# EAGLE design XEPHITS (EAGLE 9.6.2)
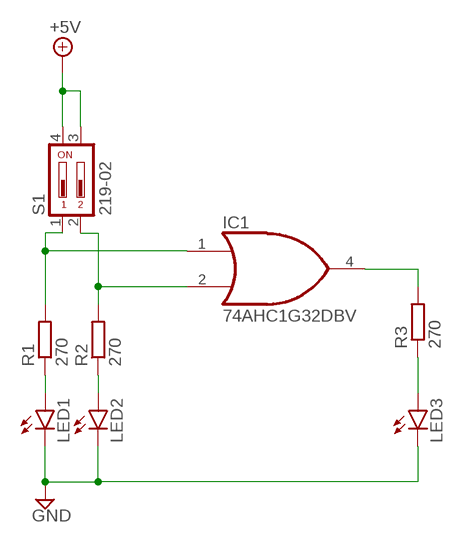
[diagram p0: schematic, sheet 1]

## Parts
IC1  74AHC1G32DBV  [SOT23-5]
LED1  LAP4-BOTTOM  [P47F-BOTTOM]
LED2  LAP4-BOTTOM  [P47F-BOTTOM]
LED3  LAP4-BOTTOM  [P47F-BOTTOM]
R1  270  R-EU_0207/2V  [0207/2V]
R2  270  R-EU_0207/2V  [0207/2V]
R3  270  R-EU_0207/2V  [0207/2V]
S1  219-02  [CTS-219-02]

## Nets
+5V: S1.3 S1.4
GND: LED1.C LED2.C LED3.C
N$1: IC1.2(I1) R2.2 S1.2
N$2: IC1.1(I0) R1.2 S1.1
N$3: LED1.A R1.1
N$4: LED2.A R2.1
N$5: IC1.4(O) R3.2
N$6: LED3.A R3.1

## Power pins joined to a net without a drawn wire
GND: IC1.3(GND)
VCC: IC1.5(VCC)

## Library data of the parts
IC1 = 74xx-little-us:74*1G32: 2-input OR gate
LED1-LED3 = led:*P4: PointLED® Enhanced Thinfilm LED TOP & BOTTOM mount LS P47F, LR P47F, LA P47F, LY P47F, LT P4SG, LB P4SG, LW P4SG Source: http://catalog.osram-os.com .. LA_LR_LS_LY_P47F_Pb_free.pdf
R1-R3 = rcl:R-EU_: RESISTOR, European symbol; SPICEPREFIX: R
S1 = switch-dil:219-02*: Surface Mount DIP Switch Series 219 SMT CTS Electronic Components Sourc: www.ctscorp.com; OC_FARNELL: unknown; OC_NEWARK: unknown

## Board
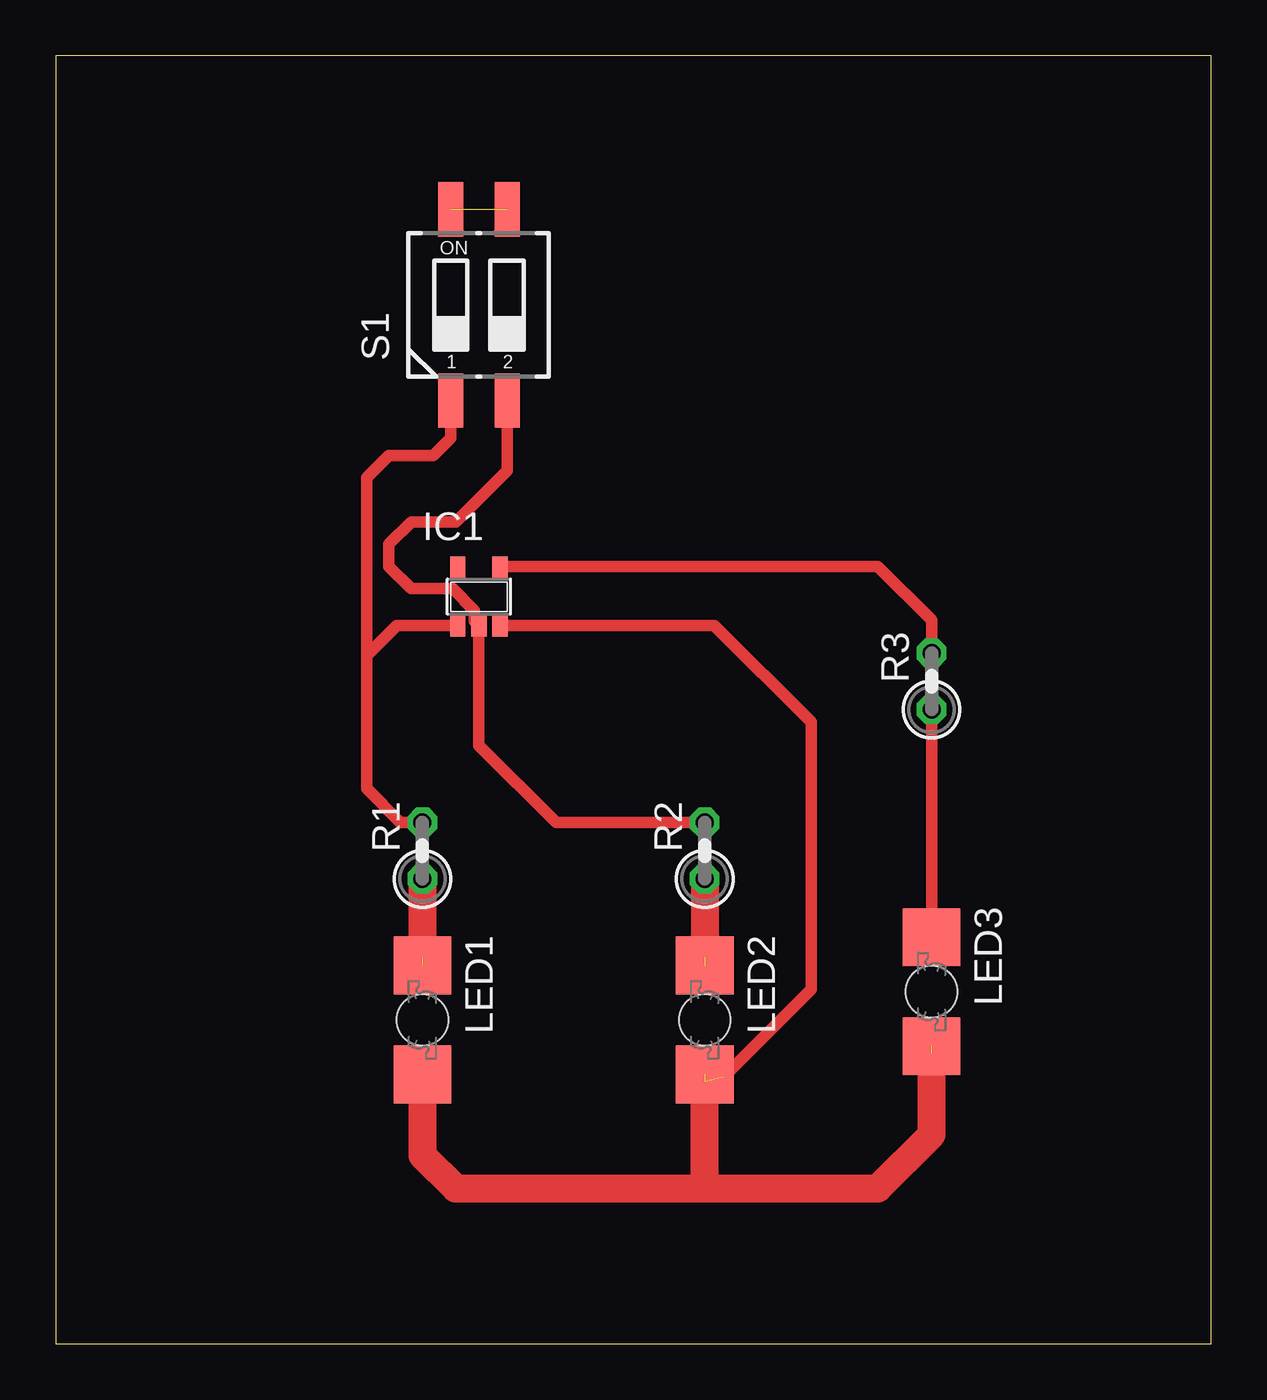
[diagram p1: board, top side]
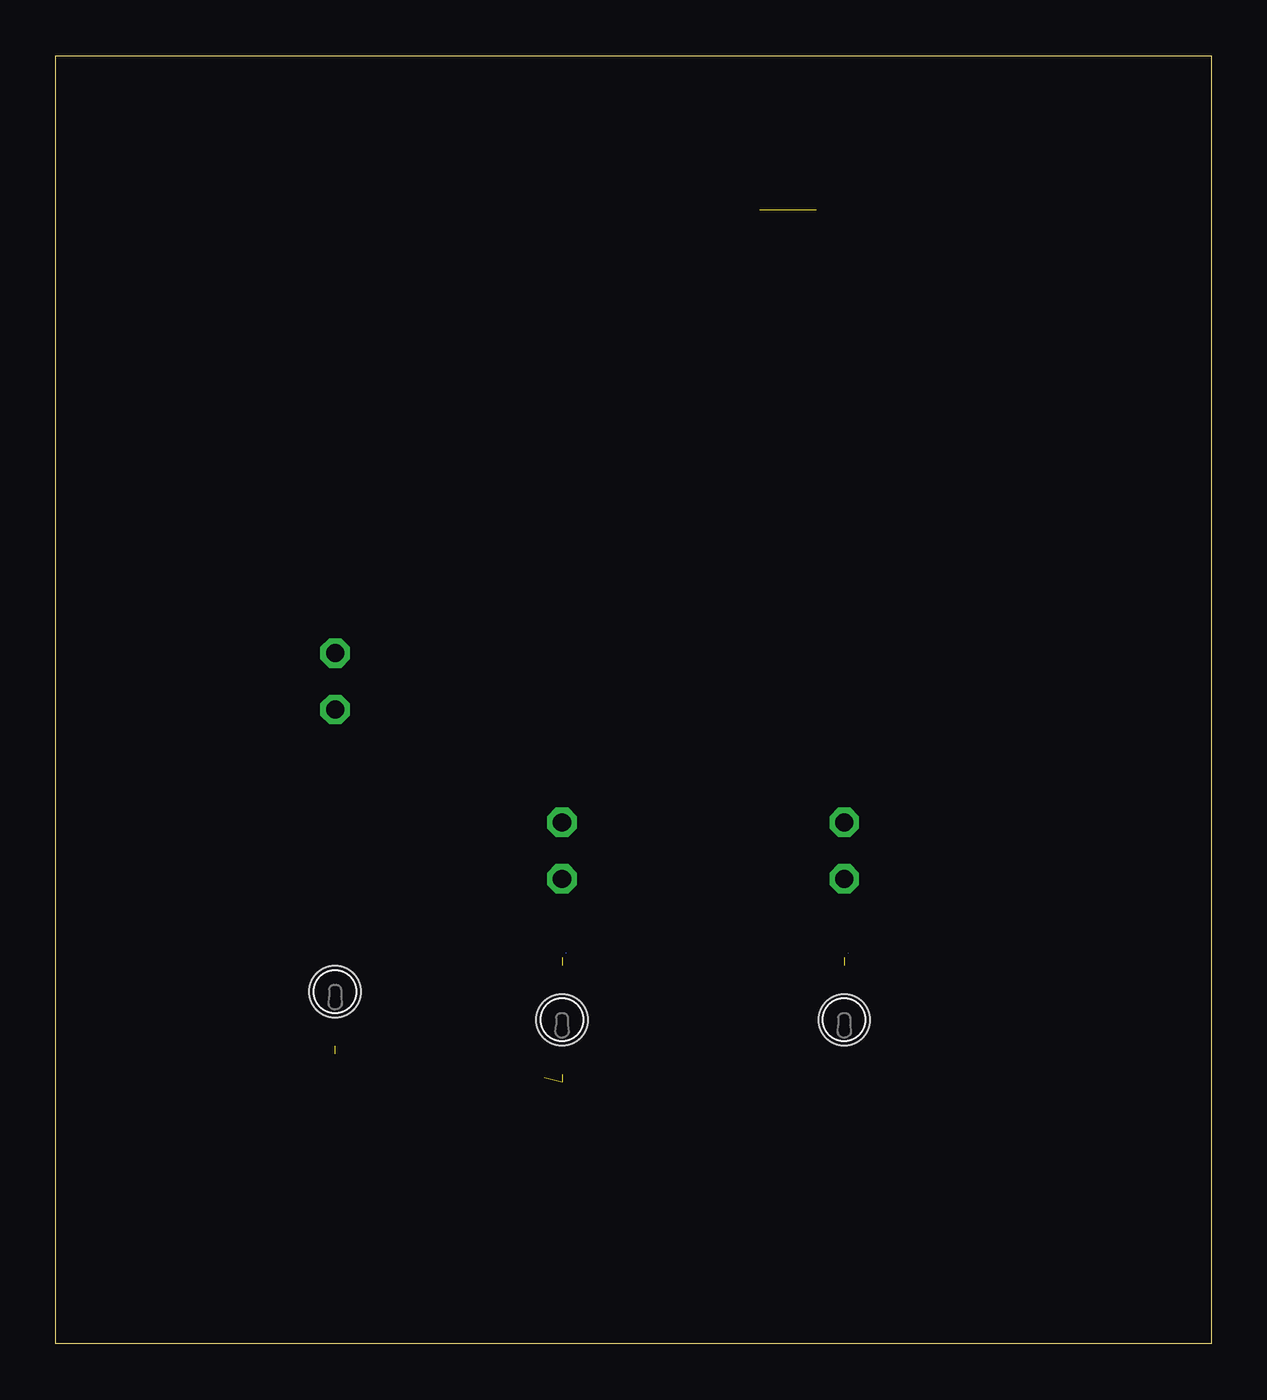
[diagram p2: board, bottom side, seen from below]

Size 52 x 58 mm. Coordinates in mm from the lower left corner, seen from the top.
Outline: 0,0 52,0 52,58 0,58 0,0
Copper layers (1*16): Top 0.035mm / dielectric 1.5mm / Bottom 0.035mm
Design rules "default": minimum track width 6mil, minimum drill 0.35mm, track to track 6mil, track to pad 6mil, pad to pad 6mil, via to via 6mil, smd to smd 6mil, copper to edge 40mil, drill to drill 6mil, minimum pad ring 10mil, minimum via ring 8mil, stop-mask expansion 4mil, vias tented up to drill 0mil, thermal gap 10mil

### Footprints (pad centres in the part's own frame; a part is rotated, then mirrored left to right if it is on the bottom)
SOT23-5 = smd 0.69 x 0.99: 1 -0.95,-1.29; 2 0,-1.29; 3 0.95,-1.29; 4 0.95,1.3; 5 -0.95,1.3
P47F-BOTTOM = smd 2.6 x 2.6: A -2.45,0; C 2.45,0 | hole 2.3: 0,0
0207/2V = drill 0.813 octagon: 1 -1.27,0; 2 1.27,0
CTS-219-02 = smd 1.13 x 2.44: 1 -1.27,-4.3; 2 1.27,-4.3; 3 1.27,4.3; 4 -1.27,4.3

### Placement (x,y rotation side)
IC1  19.05,33.64 0 top
LED1  16.51,14.59 270 top
LED2  29.21,14.59 270 top
LED3  39.42,15.86 270 top
R1  16.51,22.21 90 top
R2  29.21,22.21 90 top
R3  39.42,29.83 90 top
S1  19.05,46.77 0 top

### Tracks (layer width: path | path; a pad name or v marks a point on that pad's centre or on a via)
+5V  (1 unrouted)
GND  (3 unrouted)
  Top 0.508: IC1.3 29.65,32.35 34,28 34,15.96 30.21,12.17 30.17,12.17 30,12
  Top 1.27: LED1.C 16.51,8.49 18,7 29,7 | 29,7 29.21,7.21 29.21,11.79 | 29,7 37,7 39.42,9.42 39.42,13.06
N$1
  Top 0.508: R2.2 22.52,23.48 19.05,26.95 IC1.2 18.85,32.55 18.85,33.01 17.86,34 16,34 15,35 15,36 16,37 18,37 20.32,39.32 S1.2
N$2
  Top 0.508: IC1.1 15.35,32.35 14,31 | 14,31 14,25 15.52,23.48 R1.2 | S1.1 17.78,40.78 17,40 15,40 14,39 14,31
N$3  (1 unrouted)
  Top 1.27: R1.1 16.51,17.39
N$4  (1 unrouted)
  Top 1.27: R2.1 29.21,17.39
N$5
  Top 0.508: IC1.4 20.06,35 37,35 39.42,32.58 R3.2
N$6
  Top 0.508: R3.1 LED3.A